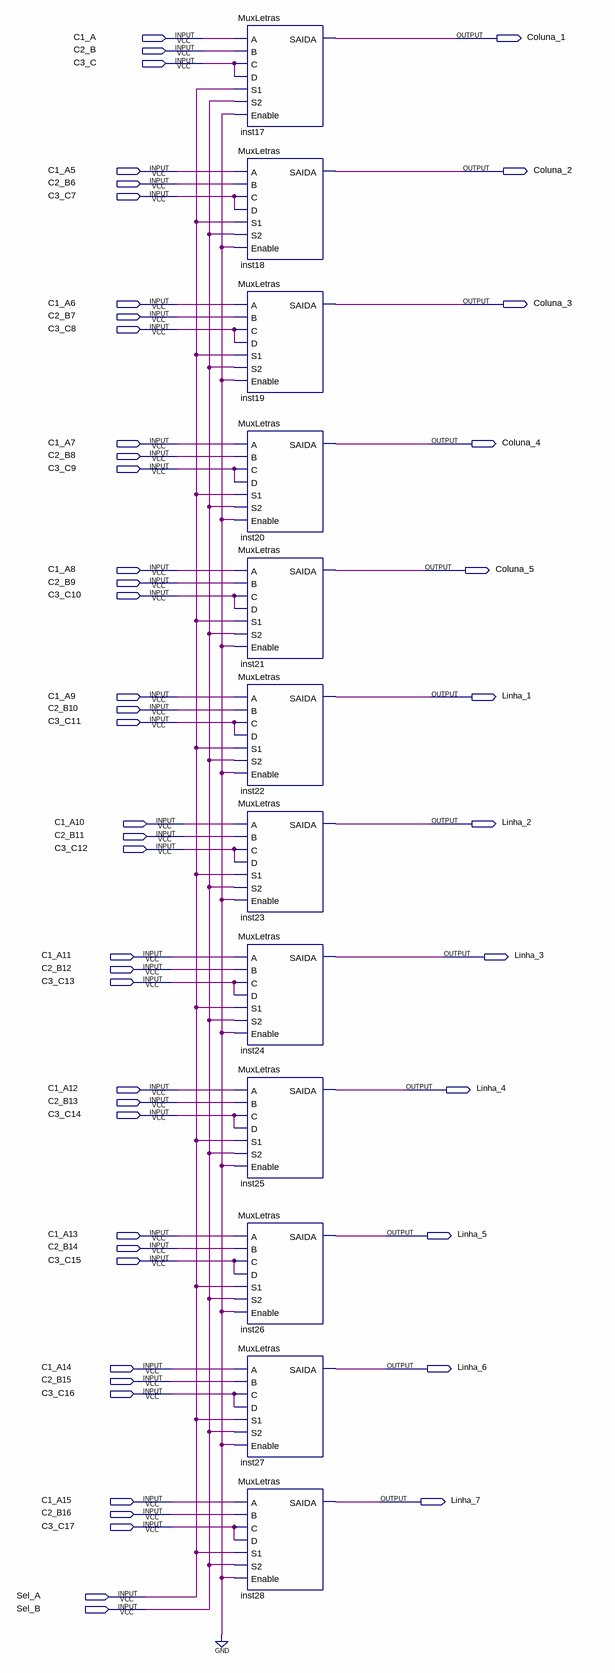
[diagram p0: schematic sheet]
// Quartus schematic GerenciadorLinhaColuna.bdf as structural Verilog: 12 symbols, 50 pins
module GerenciadorLinhaColuna (
  input  C1_A,
  input  C2_B,
  input  C3_C,
  input  C1_A5,
  input  C2_B6,
  input  C3_C7,
  input  C1_A6,
  input  C2_B7,
  input  C3_C8,
  input  C1_A7,
  input  C2_B8,
  input  C3_C9,
  input  C1_A8,
  input  C2_B9,
  input  C3_C10,
  input  C1_A9,
  input  C2_B10,
  input  C3_C11,
  input  C1_A10,
  input  C2_B11,
  input  C3_C12,
  input  C1_A11,
  input  C2_B12,
  input  C3_C13,
  input  C1_A12,
  input  C2_B13,
  input  C3_C14,
  input  C1_A13,
  input  C2_B14,
  input  C3_C15,
  input  C1_A14,
  input  C2_B15,
  input  C3_C16,
  input  C1_A15,
  input  C2_B16,
  input  C3_C17,
  input  Sel_A,
  input  Sel_B,
  output Coluna_1,
  output Coluna_2,
  output Coluna_3,
  output Coluna_4,
  output Coluna_5,
  output Linha_1,
  output Linha_2,
  output Linha_3,
  output Linha_4,
  output Linha_5,
  output Linha_6,
  output Linha_7
);

  MuxLetras inst17 (.A(C1_A), .B(C2_B), .C(C3_C), .D(C3_C), .S1(Sel_A), .S2(Sel_B), .Enable(1'b0), .SAIDA(Coluna_1));
  MuxLetras inst18 (
    .A(C1_A5), .B(C2_B6), .C(C3_C7), .D(C3_C7), .S1(Sel_A), .S2(Sel_B), .Enable(1'b0), .SAIDA(Coluna_2));
  MuxLetras inst19 (
    .A(C1_A6), .B(C2_B7), .C(C3_C8), .D(C3_C8), .S1(Sel_A), .S2(Sel_B), .Enable(1'b0), .SAIDA(Coluna_3));
  MuxLetras inst20 (
    .A(C1_A7), .B(C2_B8), .C(C3_C9), .D(C3_C9), .S1(Sel_A), .S2(Sel_B), .Enable(1'b0), .SAIDA(Coluna_4));
  MuxLetras inst21 (
    .A(C1_A8), .B(C2_B9), .C(C3_C10), .D(C3_C10), .S1(Sel_A), .S2(Sel_B), .Enable(1'b0), .SAIDA(Coluna_5));
  MuxLetras inst22 (
    .A(C1_A9), .B(C2_B10), .C(C3_C11), .D(C3_C11), .S1(Sel_A), .S2(Sel_B), .Enable(1'b0), .SAIDA(Linha_1));
  MuxLetras inst23 (
    .A(C1_A10), .B(C2_B11), .C(C3_C12), .D(C3_C12), .S1(Sel_A), .S2(Sel_B), .Enable(1'b0), .SAIDA(Linha_2));
  MuxLetras inst24 (
    .A(C1_A11), .B(C2_B12), .C(C3_C13), .D(C3_C13), .S1(Sel_A), .S2(Sel_B), .Enable(1'b0), .SAIDA(Linha_3));
  MuxLetras inst25 (
    .A(C1_A12), .B(C2_B13), .C(C3_C14), .D(C3_C14), .S1(Sel_A), .S2(Sel_B), .Enable(1'b0), .SAIDA(Linha_4));
  MuxLetras inst26 (
    .A(C1_A13), .B(C2_B14), .C(C3_C15), .D(C3_C15), .S1(Sel_A), .S2(Sel_B), .Enable(1'b0), .SAIDA(Linha_5));
  MuxLetras inst27 (
    .A(C1_A14), .B(C2_B15), .C(C3_C16), .D(C3_C16), .S1(Sel_A), .S2(Sel_B), .Enable(1'b0), .SAIDA(Linha_6));
  MuxLetras inst28 (
    .A(C1_A15), .B(C2_B16), .C(C3_C17), .D(C3_C17), .S1(Sel_A), .S2(Sel_B), .Enable(1'b0), .SAIDA(Linha_7));
endmodule
